# EAGLE design splitter (EAGLE 6.5.0)
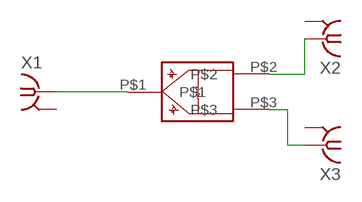
[diagram p0: schematic, sheet 1]

## Parts
U$1  WSPLITTER_2.5GHZ  [WSPLITTER_2.5GHZ]
X1  SMA-142-0701-801/806  [J502-ND-142-0701-801/806]
X2  SMA-142-0701-801/806  [J502-ND-142-0701-801/806]
X3  SMA-142-0701-801/806  [J502-ND-142-0701-801/806]

## Nets
IN: U$1.P$1 X1.1
O2: U$1.P$2 X2.1
O3: U$1.P$3 X3.1
Unconnected: X1.G@1 X1.G@2 X1.G@3 X1.G@4 X2.G@1 X2.G@2 X2.G@3 X2.G@4 X3.G@1 X3.G@2 X3.G@3 X3.G@4

## Library data of the parts
U$1 = ECE532_Parts:WSPLITTER_2.5GHZ
X1-X3 = con-coax:SMA-: SMA 50 Ohm End Launch Jack Receptacle - Round Contact Johnson Components Source: www.johnsoncomponents.com .. J502-ND.pdf; MF: JOHNSON COMPONENTS; MPN: 142-0701-801; OC_FARNELL: 1608592; OC_NEWARK: 90F2624

## Board
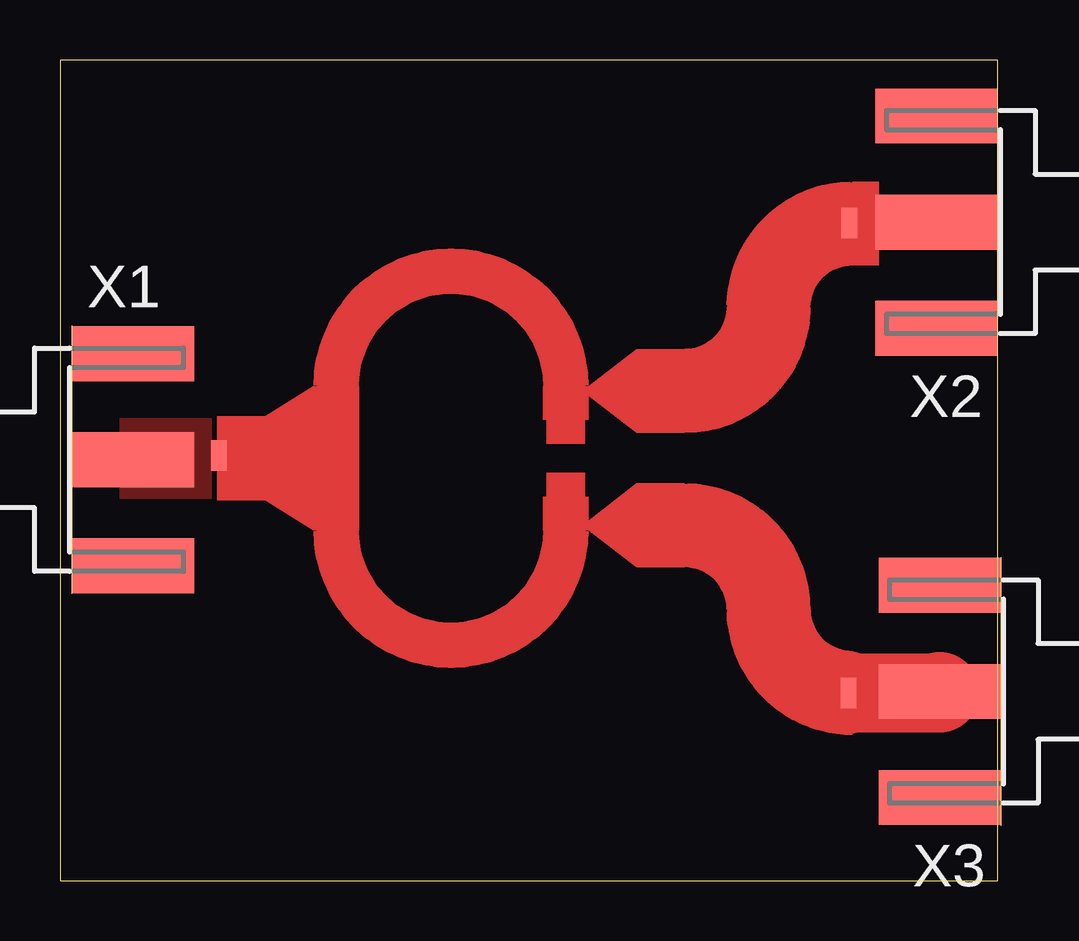
[diagram p1: board, top side]
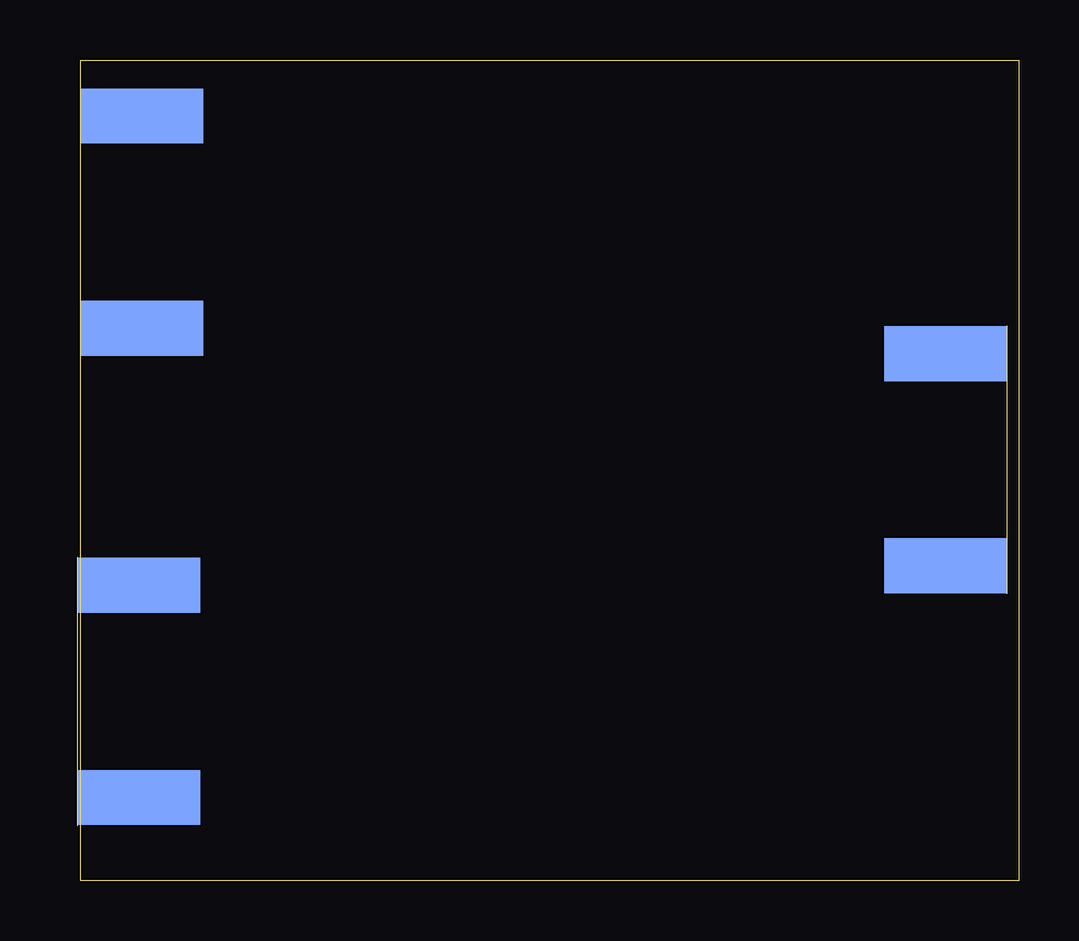
[diagram p2: board, bottom side, seen from below]

Size 39.1 x 34.2 mm. Coordinates in mm from the lower left corner, seen from the top.
Outline: 0,0 39.1,0 39.1,34.2 0,34.2 0,0
Copper layers (1*16): Top 0.035mm / dielectric 1.5mm / Bottom 0.035mm
Design rules "default": minimum track width 10mil, minimum drill 24mil, track to track 8mil, track to pad 8mil, pad to pad 8mil, via to via 8mil, smd to smd 8mil, copper to edge 40mil, drill to drill 8mil, minimum pad ring 10mil, minimum via ring 8mil, stop-mask expansion 4mil, vias tented up to drill 0mil, thermal gap 10mil

### Footprints (pad centres in the part's own frame; a part is rotated, then mirrored left to right if it is on the bottom)
WSPLITTER_2.5GHZ = smd 0.635 x 1.27: P$1 -9.743,-0.194; P$2 16.528,9.479; P$3 16.499,-10.092
J502-ND-142-0701-801/806 = smd 5.08 x 2.286: 1 2.565,0; G@1 2.565,4.42; G@2 2.565,-4.42 | smd 5.08 x 2.286 bottom: G@3 2.565,4.42; G@4 2.565,-4.42

### Placement (x,y rotation side)
U$1  16.37,17.92 0 top
X1  0.5,17.54 0 top
X2  39.1,27.45 180 top
X3  39.23,7.89 180 top

### Tracks (layer width: path | path; a pad name or v marks a point on that pad's centre or on a via)
IN
  pour Top (no thermals): 7.78,19.26 2.49,19.26 2.49,15.94 7.79,15.94 7.79,19.24
O2
  Top 0.01: U$1.P$2 36.54,27.4
  Top 0.05: 36.54,27.4 X2.1
  pour Top (no thermals): 31.85,27.42 31.85,27.41 31.85,27.42
  pour Top: 29.48,24.47 29.48,24.45 29.1,24.45
O3
  Top 3.3: U$1.P$3 36.67,7.83 X3.1
(copper drawn outside any net)
  shapes: Top area x1